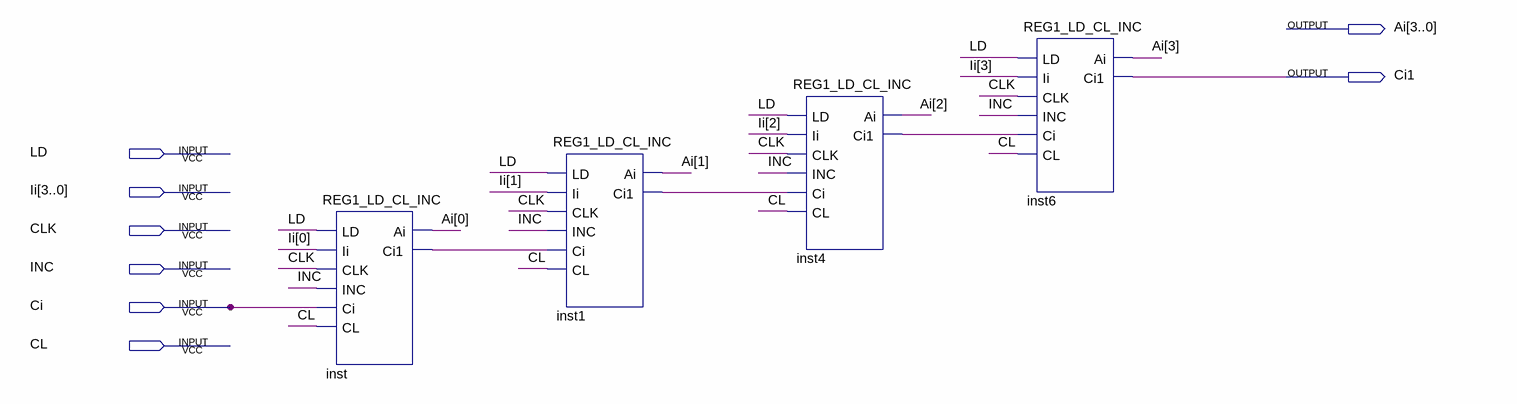
[diagram p0: schematic sheet]
// Quartus schematic REG4_LD_CL_INC.bdf as structural Verilog: 4 symbols, 8 pins
module REG4_LD_CL_INC (
  input  LD,
  input  [3:0] Ii,
  input  CLK,
  input  INC,
  input  Ci,
  input  CL,
  output [3:0] Ai,
  output Ci1
);

  wire inst1_ci1, inst4_ci1, inst_ci1;

  REG1_LD_CL_INC inst (.LD(LD), .Ii(Ii[0]), .CLK(CLK), .INC(INC), .Ci(Ci), .CL(CL), .Ai(Ai[0]), .Ci1(inst_ci1));
  REG1_LD_CL_INC inst1 (.LD(LD), .Ii(Ii[1]), .CLK(CLK), .INC(INC), .Ci(inst_ci1), .CL(CL), .Ai(Ai[1]), .Ci1(inst1_ci1));
  REG1_LD_CL_INC inst4 (
    .LD(LD), .Ii(Ii[2]), .CLK(CLK), .INC(INC), .Ci(inst1_ci1), .CL(CL), .Ai(Ai[2]), .Ci1(inst4_ci1));
  REG1_LD_CL_INC inst6 (.LD(LD), .Ii(Ii[3]), .CLK(CLK), .INC(INC), .Ci(inst4_ci1), .CL(CL), .Ai(Ai[3]), .Ci1(Ci1));
endmodule
